# Altium schematic sheet waterLEDSheet.SchDoc
size A4
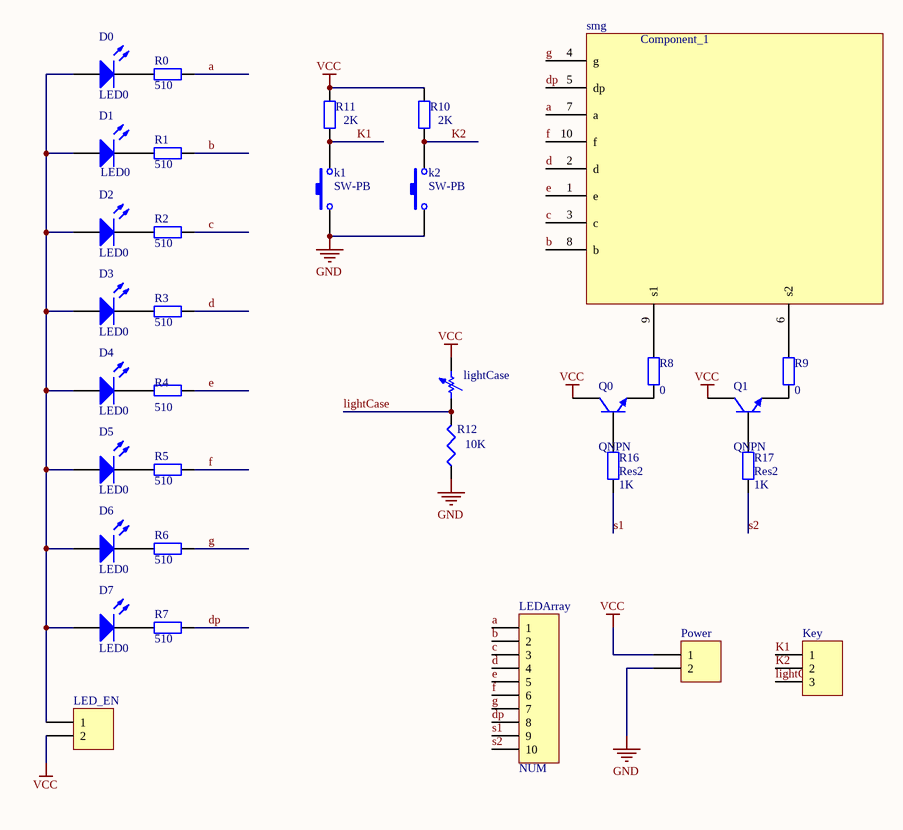
[diagram p0: waterLEDSheet.SchDoc]

## Parts
D0  LED0  [C1210_M]
D1  LED0  [C1210_M]
D2  LED0  [C1210_M]
D3  LED0  [C1210_M]
D4  LED0  [C1210_M]
D5  LED0  [C1210_M]
D6  LED0  [C1210_M]
D7  LED0  [C1210_M]
k1  SW-PB  [KEY_SODFL_2-Leads]
k2  SW-PB  [KEY_SODFL_2-Leads]
Key  (no value)  [HDR1X3]
LED_EN  (no value)  [HDR1X2]
LEDArray  NUM  [HDR1X10]
lightCase  (no value)  [RAD-0.2]
Power  Header 2  [HDR1X2]  (value not drawn)
Q0  QNPN  [SOT23_M]
Q1  QNPN  [SOT23_M]
R0  510  [6-0805_N]
R1  510  [6-0805_N]
R2  510  [6-0805_N]
R3  510  [6-0805_N]
R4  510  [6-0805_N]
R5  510  [6-0805_N]
R6  510  [6-0805_N]
R7  510  [6-0805_N]
R8  value 0  [6-0805_N]
R9  value 0  [6-0805_N]
R10  value 2K  [6-0805_N]
R11  value 2K  [6-0805_N]
R12  value 10K  [6-0805_N]  (hidden comment: Res3)
R16  Res2  value 1K  [6-0805_N]
R17  Res2  value 1K  [6-0805_N]
smg  Component_1  [Nixie_light]

## Nets
GND: k1.1 k2.1 Power.2 R12.1
VCC: LED_EN.2 lightCase.2 Power.1 Q0.1(C) Q1.1(C) R10.1 R11.2
a: LEDArray.1 R0.2 smg.7(a)
b: LEDArray.2 R1.2 smg.8(b)
c: LEDArray.3 R2.2 smg.3(c)
d: LEDArray.4 R3.2 smg.2(d)
dp: LEDArray.8 R7.2 smg.5(dp)
e: LEDArray.5 R4.2 smg.1(e)
f: LEDArray.6 R5.2 smg.10(f)
g: LEDArray.7 R6.2 smg.4(g)
K1: k1.2 Key.1 R11.1
K2: k2.2 Key.2 R10.2
lightCase: Key.3 lightCase.1 R12.2
s1: LEDArray.9 R16.1
s2: LEDArray.10 R17.1
NetD0_1: D0.1(A) D1.1(A) D2.1(A) D3.1(A) D4.1(A) D5.1(A) D6.1(A) D7.1(A) LED_EN.1
NetD0_2: D0.2(K) R0.1
NetD1_2: D1.2(K) R1.1
NetD2_2: D2.2(K) R2.1
NetD3_2: D3.2(K) R3.1
NetD4_2: D4.2(K) R4.1
NetD5_2: D5.2(K) R5.1
NetD6_2: D6.2(K) R6.1
NetD7_2: D7.2(K) R7.1
NetQ0_2: Q0.2(B) R16.2
NetQ0_3: Q0.3(E) R8.1
NetQ1_2: Q1.2(B) R17.2
NetQ1_3: Q1.3(E) R9.1
NetR8_2: R8.2 smg.9(s1)
NetR9_2: R9.2 smg.6(s2)

## Library data of the parts
D0-D7 = LED0: Typical INFRARED GaAs LED; Published: 8-Jun-2000; LatestRevisionDate: 08-Jul-2005; LatestRevisionNote: Mech Layer 1 removed.; PackageReference: LED-0; Publisher: Altium Limited; PackageDescription: LED; 2 Leads
k1 k2 = SW-PB: Switch; Published: 24-Mar-1999; LatestRevisionDate: 17-Jul-2002; LatestRevisionNote: Re-released for DXP Platform.; PackageReference: SPST-2; Publisher: Altium Limited; PackageDescription: Switch; 2 Leads
Key = Header 3: Header, 3-Pin; LatestRevisionDate: 17-Jul-2002; LatestRevisionNote: Re-released for DXP Platform.; Publisher: Altium Limited
LED_EN Power = Header 2: Header, 2-Pin; LatestRevisionDate: 17-Jul-2002; LatestRevisionNote: Re-released for DXP Platform.; Publisher: Altium Limited
LEDArray = Header 10: Header, 10-Pin; LatestRevisionDate: 17-Jul-2002; LatestRevisionNote: Re-released for DXP Platform.; Publisher: Altium Limited
lightCase = Res Adj1: Variable Resistor; Value: 1K; Set Position: 0.5; Published: 8-Jun-2000; LatestRevisionDate: 17-Jul-2002; LatestRevisionNote: Re-released for DXP Platform.; PackageReference: AXIAL-0.7; Publisher: Altium Limited; PackageDescription: Axial Device, Thru-Hole; 2 Leads; 0.7 in Pin Spacing
Q0 Q1 = QNPN: NPN Bipolar Transistor; Published: 8-Jun-2000; LatestRevisionDate: 29-May-2009; LatestRevisionNote: IPC-7351 Footprint Added.; PackageVersion: Aug-1999; PackageReference: SOT-23B; Publisher: Altium Limited; PackageDescription: 3-Pin SOT-23 Package 0.95 mm Pitch, 2.4 mm Lead Span
R0-R11 R16 R17 = Res2: Resistor; Published: 8-Jun-2000; LatestRevisionDate: 17-Jul-2002; LatestRevisionNote: Re-released for DXP Platform.; PackageReference: AXIAL-0.4; Publisher: Altium Limited; PackageDescription: Axial Device, Thru-Hole; 2 Leads; 0.4 in Pin Spacing
R12 = Res3: Resistor; Published: 8-Jun-2000; LatestRevisionDate: 29-May-2009; LatestRevisionNote: IPC-7351 Footprint Added.; PackageReference: J1-0603; Publisher: Altium Limited; PackageDescription: Chip Resistor